# Altium schematic sheet EEPROM.SchDoc: EEPROM
size A; Organization: UCLA High Energy Physics; Address1: L3, 12a Rodborough Rd; Address2: Frenchs Forest; Address3: NSW; Address4: Australia 2086; DocumentNumber: 13; Revision: 2.0; SheetNumber: 13; SheetTotal: 23; CurrentDate: 9/6/2018; ModifiedDate: 9/6/2018; ProjectName: Project
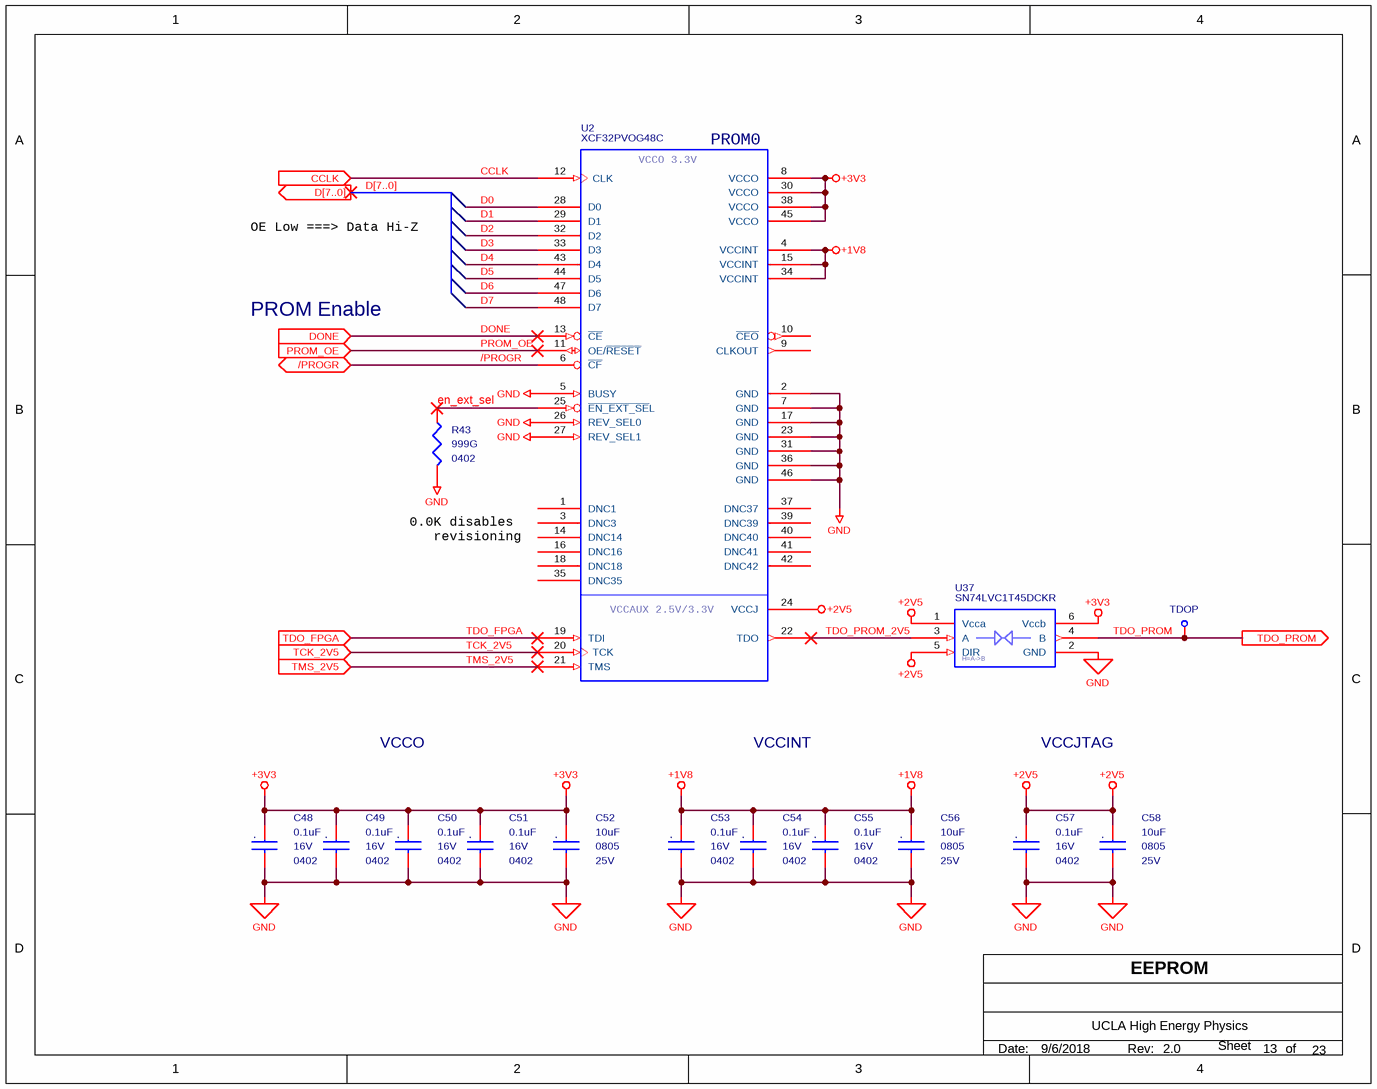
[diagram p0: EEPROM.SchDoc]

## Parts
C48  0.1uF  package: 0402  Voltage - Rated: 16V  [MC_S6/SM/C_0402_IPC]
C49  0.1uF  package: 0402  Voltage - Rated: 16V  [MC_S6/SM/C_0402_IPC]
C50  0.1uF  package: 0402  Voltage - Rated: 16V  [MC_S6/SM/C_0402_IPC]
C51  0.1uF  package: 0402  Voltage - Rated: 16V  [MC_S6/SM/C_0402_IPC]
C52  10uF  Voltage - Rated: 25V  package: 0805  [MC_S6/SM/C_0805_IPC]
C53  0.1uF  package: 0402  Voltage - Rated: 16V  [MC_S6/SM/C_0402_IPC]
C54  0.1uF  package: 0402  Voltage - Rated: 16V  [MC_S6/SM/C_0402_IPC]
C55  0.1uF  package: 0402  Voltage - Rated: 16V  [MC_S6/SM/C_0402_IPC]
C56  10uF  Voltage - Rated: 25V  package: 0805  [MC_S6/SM/C_0805_IPC]
C57  0.1uF  package: 0402  Voltage - Rated: 16V  [MC_S6/SM/C_0402_IPC]
C58  10uF  Voltage - Rated: 25V  package: 0805  [MC_S6/SM/C_0805_IPC]
R43  999G  Supplier Device Package: 0402  [MC_S6/SM/R_0402_IPC]  (no BOM)
TDOP  Test Point Via  [MC_S6/TH/TPVIA]  (value not drawn)  (no BOM)
U2  XCF32PVOG48C  [MC_S6/SM/VOG48]
U37  SN74LVC1T45DCKR  [MC_S6/SM/SOT_SC70_DCK6]

## Ports
/PROGR (bidir), CCLK (in), D[7..0] (out), DONE (in), PROM_OE (in), TCK_2V5 (in), TDO_FPGA (in), TDO_PROM (out), TMS_2V5 (in)

## Nets
+1V8: C53.1 C54.1 C55.1 C56.1 U2.4(VCCINT) U2.15(VCCINT) U2.34(VCCINT)
+2V5: C57.1 C58.1 U2.24(VCCJ) U37.1(Vcca) U37.5(DIR)
+3V3: C48.1 C49.1 C50.1 C51.1 C52.1 U2.8(VCCO) U2.30(VCCO) U2.38(VCCO) U2.45(VCCO) U37.6(Vccb)
GND: C48.2 C49.2 C50.2 C51.2 C52.2 C53.2 C54.2 C55.2 C56.2 C57.2 C58.2 R43.2 U2.2(GND) U2.5(BUSY) U2.7(GND) U2.17(GND) U2.23(GND) U2.26(REV_SEL0) U2.27(REV_SEL1) U2.31(GND) U2.36(GND) U2.46(GND) U37.2(GND)
/PROGR: U2.6(~{CF}) ; port /PROGR
CCLK: U2.12(CLK) ; port CCLK
D0: U2.28(D0)
D1: U2.29(D1)
D2: U2.32(D2)
D3: U2.33(D3)
D4: U2.43(D4)
D5: U2.44(D5)
D6: U2.47(D6)
D7: U2.48(D7)
DONE: U2.13(~{CE}) ; port DONE
en_ext_sel: R43.1 U2.25(~{EN_EXT_SE}L)
PROM_OE: U2.11(OE/~{RESET}) ; port PROM_OE
TCK_2V5: U2.20(TCK) ; port TCK_2V5
TDO_FPGA: U2.19(TDI) ; port TDO_FPGA
TDO_PROM: TDOP.1(In) U37.4(B) ; port TDO_PROM
TDO_PROM_2V5: U2.22(TDO) U37.3(A)
TMS_2V5: U2.21(TMS) ; port TMS_2V5

Not connected (* = marked no-connect by the designer): U2 1(DNC1) 3(DNC3) 9(CLKOUT) 10(~{CEO}) 14(DNC14) 16(DNC16) 18(DNC18) 35(DNC35) 37(DNC37) 39(DNC39) 40(DNC40) 41(DNC41) 42(DNC42)

## Buses and harness runs
bus D[7..0] = port D[7..0]

## Notes on the sheet
- (near U2) PROM0
- OE Low ===> Data Hi-Z
- PROM Enable
- 0.0K disables
  revisioning
- VCCO
- VCCINT
- VCCJTAG
- Date:
- Rev:
- of
- Sheet
- (in symbol C0402C104K4RACTU) .
- (in symbol GRM21BR61E106KA73L) .
- (in symbol SN74LVC1T45-EP-ALCT_1) H=A->B
- (in symbol XCF32PVOG48C) VCCO 3.3V; VCCAUX 2.5V/3.3V

## Library data of the parts
C48-C51 C53-C55 C57 = C0402C104K4RACTU: CAP CER 0.1UF 16V X7R 0402; Manufacturer: KEMET; Capacitance: 0.10µF; Tolerance: ±10%; Supplier 1: Digi-Key; Manufacturer Part Number: C0402C104K4RACTU; RoHS: RoHS Compliant; Category: Capacitors; Stock 1: 3565698; Pricing 1: 1=0.11, 10=0.078, 25=0.0568, 50=0.0442, 100=0.0365, 250=0.03024, 500=0.02562, 1000=0.02121, 5000=0.01806 (USD); Packaging: Cut Tape (CT); Part Status: Active; Operating Temperature: -55°C ~ 125°C; Features: -; Ratings: -; Applications: General Purpose; Failure Rate: -; Mounting Type: Surface Mount, MLCC; Package / Case: 0402 (1005 Metric); Size / Dimension: 0.039" L x 0.020" W (1.00mm x 0.50mm); Height - Seated (Max): -; Thickness (Max): 0.022" (0.55mm); Lead Spacing: -; Lead Style: -; ComponentLink1URL: http://www.kemet.com/docfinder?Partnumber=C0402C104K4RACTU; ComponentLink1Description: http://www.kemet.com/docfinder?Partnumber=C0402C104K4RACTU; Supplier 2: Digi-Key; Stock 2: 3565998; Pricing 2: 1=0.11, 10=0.078, 25=0.0568, 50=0.0442, 100=0.0365, 250=0.03024, 500=0.02562, 1000=0.02121, 5000=0.01806 (USD); Supplier Part Number 1: 399-3521-1-ND; Supplier Part Number 2: 399-3521-6-ND; Temperature Coefficient: X7R
C52 C56 C58 = GRM21BR61E106KA73L: CAP CER 10UF 25V X5R 0805; Manufacturer: Murata Electronics North America; Capacitance: 10µF; Tolerance: ±10%; Supplier 1: Digi-Key; Manufacturer Part Number: GRM21BR61E106KA73L; RoHS: RoHS Compliant; Category: Capacitors; Stock 1: 607428; Pricing 1: 1=0.19, 10=0.13, 50=0.0748, 100=0.0618, 250=0.052, 500=0.04356, 1000=0.03575 (USD); Packaging: Cut Tape (CT); Part Status: Active; Operating Temperature: -55°C ~ 85°C; Mounting Type: Surface Mount, MLCC; Size / Dimension: 0.079" L x 0.049" W (2.00mm x 1.25mm); Height - Seated (Max): -; Lead Spacing: -; Features: -; ComponentLink1URL: http://www.murata.com/~/media/webrenewal/support/library/catalog/products/capacitor/mlcc/c02e.pdf; ComponentLink1Description: http://www.murata.com/~/media/webrenewal/support/library/catalog/products/capacitor/mlcc/c02e.pdf; Supplier 2: Digi-Key; Supplier Part Number 1: 490-5523-1-ND; Supplier Part Number 2: 490-5523-6-ND; Package / Case: 0805 (2012 Metric); Temperature Coefficient: X5R; Ratings: -; Applications: General Purpose; Thickness (Max): 0.053" (1.35mm); Lead Style: -
R43 = RES999G 0402: RES SMD 999G OHM 5% 1/16W 0402; Manufacturer Part Number: Do Not Place
TDOP = TPVIA: COMPSIDE: TOP; COMPGROUP: 0; mfgr: Layout; COMPROT: 0; Package: 90; mfgr_id: TPVIA; mfgr_foot: TPVIA
U2 = XCF32PVOG48C: IC PROM SRL/PAR 1.8V 32M 48TSOP; Manufacturer: Xilinx Inc.; COMPSIDE: TOP; COMPGROUP: 0; COMPROT: 270; mfgr: Xilinx; mfgr_foot: VOG48; Programmable Type: In System Programmable; Memory Size: 32Mb; Voltage - Supply: 1.65 V ~ 2 V; mfgr_id: XCF32PVOG48C; Supplier 1: Digi-Key; Manufacturer Part Number: XCF32PVOG48C; RoHS: RoHS Compliant; Category: Integrated Circuits (ICs); Stock 1: 1063; Pricing 1: 1=27.23 (USD); Packaging: Tube; Part Status: Active; Operating Temperature: -40°C ~ 85°C; Package / Case: 48-TFSOP (0.724", 18.40mm Width); Supplier Device Package: 48-TSOP; ComponentLink1URL: http://www.xilinx.com/support/documentation/data_sheets/ds123.pdf; ComponentLink1Description: http://www.xilinx.com/support/documentation/data_sheets/ds123.pdf; Supplier Part Number 1: 122-1458-ND
U37 = SN74LVC1T45-EP-ALCT_1: IC BUS TRANSCVR TRI-ST SC70-6; Manufacturer: Texas Instruments; COMPSIDE: TOP; COMPGROUP: 0; COMPROT: 270; mfgr_id: SN74LVC1T45MDCKREP; mfgr: Texas Inst; mfgr_foot: DCK; Translator Type: Voltage Level; Channel Type: Bidirectional; Channels per Circuit: 1; Output Type: Tri-State, Non-Inverted; Data Rate: 420Mbps; Supplier 1: Digi-Key; Manufacturer Part Number: SN74LVC1T45DCKR; RoHS: RoHS Compliant; Category: Integrated Circuits (ICs); Stock 1: 91787; Pricing 1: 1=0.58, 10=0.494, 100=0.3692, 500=0.29004, 1000=0.22413 (USD); Packaging: Cut Tape (CT); Part Status: Active; Input Signal: -; Output Signal: -; Operating Temperature: -40°C ~ 85°C (TA); Features: -; Mounting Type: Surface Mount; Package / Case: 6-TSSOP, SC-88, SOT-363; Supplier Device Package: SC-70-6; ComponentLink1URL: http://www.ti.com/lit/ds/symlink/sn74lvc1t45.pdf; ComponentLink1Description: http://www.ti.com/lit/ds/symlink/sn74lvc1t45.pdf; Supplier 2: Digi-Key; Stock 2: 91787; Pricing 2: 1=0.58, 10=0.494, 100=0.3692, 500=0.29004, 1000=0.22413 (USD); Supplier Part Number 1: 296-16844-1-ND; Supplier Part Number 2: 296-16844-6-ND